# Altium schematic sheet control.SchDoc
size B
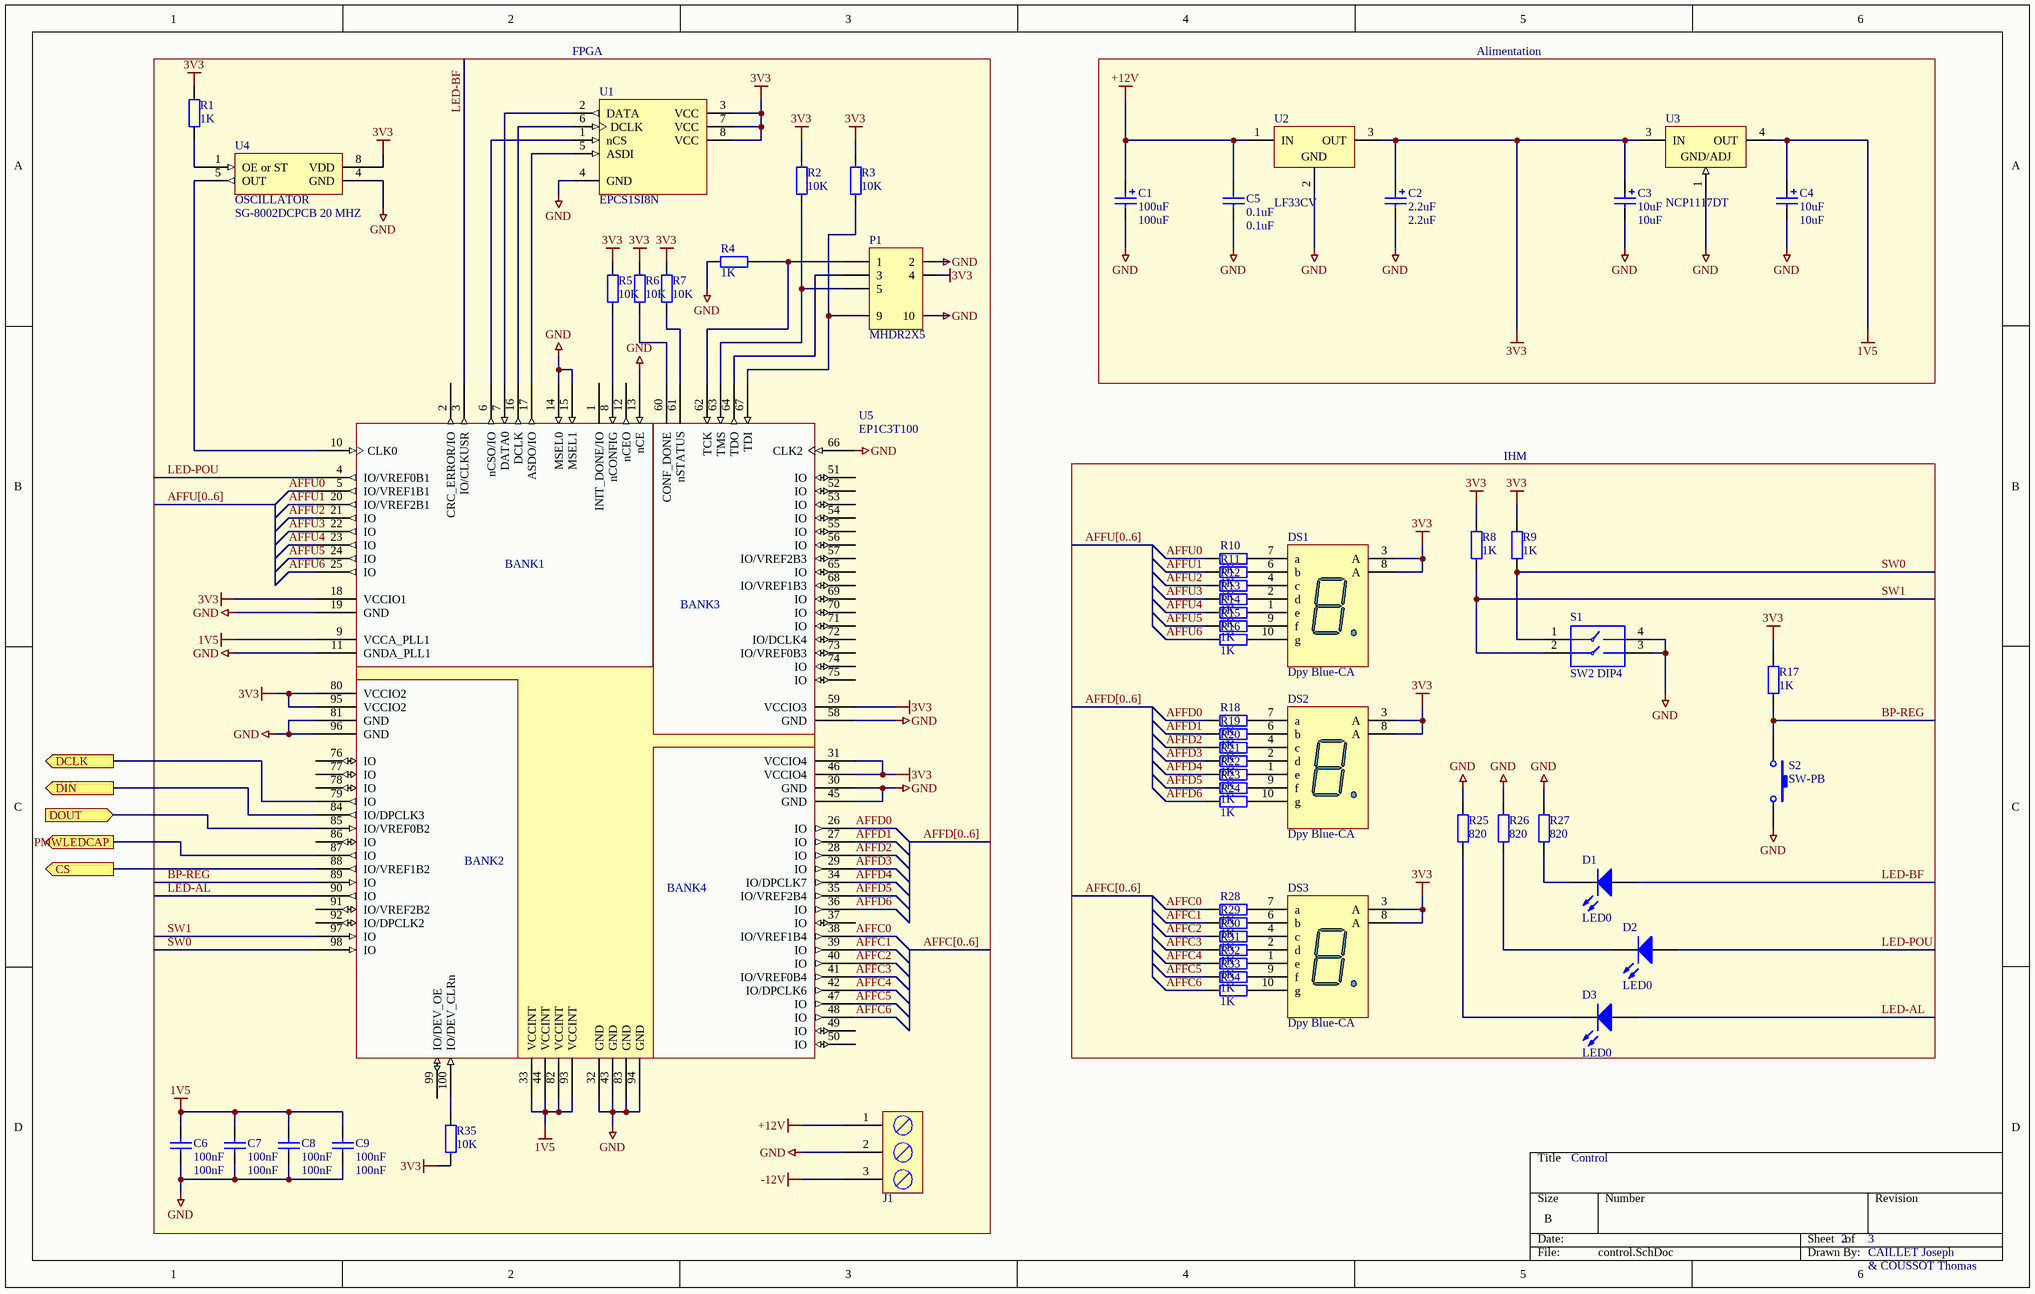
[diagram p0: control.SchDoc]

## Parts
C1  100uF  [RB0.14/0.35]
C2  2.2uF  [RB0.1/0.2]
C3  10uF  [RB0.1/0.2]
C4  10uF  [RB0.1/0.2]
C5  0.1uF  [RAD-0.2]
C6  100nF  [RAD-0.2]
C7  100nF  [RAD-0.2]
C8  100nF  [RAD-0.2]
C9  100nF  [RAD-0.2]
D1  LED0  [led-3mm]
D2  LED0  [led-3mm]
D3  LED0  [led-3mm]
DS1  Dpy Blue-CA  [AFF7SEG-14MM]
DS2  Dpy Blue-CA  [AFF7SEG-14MM]
DS3  Dpy Blue-CA  [AFF7SEG-14MM]
J1  BORNIER 3 VIS  [BORNIER-3]  (value not drawn)
P1  MHDR2X5  [HE10-2X5M]
R1  1K  [AXIAL-0.4]
R2  10K  [AXIAL-0.4]
R3  10K  [AXIAL-0.4]
R4  1K  [AXIAL-0.4]
R5  10K  [AXIAL-0.4]
R6  10K  [AXIAL-0.4]
R7  10K  [AXIAL-0.4]
R8  1K  [AXIAL-0.4]
R9  1K  [AXIAL-0.4]
R10  1K  [AXIAL-0.4]
R11  1K  [AXIAL-0.4]
R12  1K  [AXIAL-0.4]
R13  1K  [AXIAL-0.4]
R14  1K  [AXIAL-0.4]
R15  1K  [AXIAL-0.4]
R16  1K  [AXIAL-0.4]
R17  1K  [AXIAL-0.4]
R18  1K  [AXIAL-0.4]
R19  1K  [AXIAL-0.4]
R20  1K  [AXIAL-0.4]
R21  1K  [AXIAL-0.4]
R22  1K  [AXIAL-0.4]
R23  1K  [AXIAL-0.4]
R24  1K  [AXIAL-0.4]
R25  820  [AXIAL-0.4]
R26  820  [AXIAL-0.4]
R27  820  [AXIAL-0.4]
R28  1K  [AXIAL-0.4]
R29  1K  [AXIAL-0.4]
R30  1K  [AXIAL-0.4]
R31  1K  [AXIAL-0.4]
R32  1K  [AXIAL-0.4]
R33  1K  [AXIAL-0.4]
R34  1K  [AXIAL-0.4]
R35  10K  [AXIAL-0.4]
S1  SW2 DIP4  [DIP-4]
S2  SW-PB  [BP-MJTP12]
U1  EPCS1SI8N  [DIP-8]
U2  LF33CV  [REG-TO220]
U3  NCP1117DT  [REG-DPAK]
U4  SG-8002DCPCB 20 MHZ  [DIP-8]
U5  EP1C3T100  [SUPPORT-TQFP100]

## Blocks framed on the sheet
FPGA: C6-C9 J1 P1 R1-R7 R35 U1 U4 U5
Alimentation: C1-C5 U2 U3
IHM: D1-D3 DS1-DS3 R8-R34 S1 S2

## Ports
CS (out), DCLK (out), DIN (out), DOUT (in), PMWLEDCAP (out)

## Nets
1V5: C4.1 C6.2 C7.2 C8.2 C9.2 U3.4(OUT) U5.9(VCCA_PLL1) U5.33(VCCINT) U5.44(VCCINT) U5.82(VCCINT) U5.93(VCCINT)
3V3: C2.1 C3.1 DS1.3(A) DS1.8(A) DS2.3(A) DS2.8(A) DS3.3(A) DS3.8(A) P1.4 R1.1 R2.1 R3.1 R5.1 R6.1 R7.1 R8.2 R9.2 R17.2 R35.2 U1.3(VCC) U1.7(VCC) U1.8(VCC) U2.3(OUT) U3.3(IN) U4.8(VDD) U5.18(VCCIO1) U5.31(VCCIO4) U5.46(VCCIO4) U5.59(VCCIO3) U5.80(VCCIO2) U5.95(VCCIO2)
+12V: C1.1 C5.2 J1.1(X) U2.1(IN)
-12V: J1.3
GND: C1.2 C2.2 C3.2 C4.2 C5.1 C6.1 C7.1 C8.1 C9.1 J1.2 P1.2 P1.10 R4.2 R25.2 R26.2 R27.2 S1.3 S1.4 S2.2 U1.4(GND) U2.2(GND) U3.1(GND/ADJ) U4.4(GND) U5.11(GNDA_PLL1) U5.13(nCE) U5.14(MSEL0) U5.15(MSEL1) U5.19(GND) U5.30(GND) U5.32(GND) U5.43(GND) U5.45(GND) U5.58(GND) U5.66(CLK2) U5.81(GND) U5.83(GND) U5.94(GND) U5.96(GND)
AFFC0: R28.1 U5.38(IO/VREF1B4)
AFFC1: R29.1 U5.39(IO)
AFFC2: R30.1 U5.40(IO)
AFFC3: R31.1 U5.41(IO/VREF0B4)
AFFC4: R32.1 U5.42(IO/DPCLK6)
AFFC5: R33.1 U5.47(IO)
AFFC6: R34.1 U5.48(IO)
AFFD0: R18.1 U5.26(IO)
AFFD1: R19.1 U5.27(IO)
AFFD2: R20.1 U5.28(IO)
AFFD3: R21.1 U5.29(IO)
AFFD4: R22.1 U5.34(IO/DPCLK7)
AFFD5: R23.1 U5.35(IO/VREF2B4)
AFFD6: R24.1 U5.36(IO)
AFFU0: R10.1 U5.5(IO/VREF1B1)
AFFU1: R11.1 U5.20(IO/VREF2B1)
AFFU2: R12.1 U5.21(IO)
AFFU3: R13.1 U5.22(IO)
AFFU4: R14.1 U5.23(IO)
AFFU5: R15.1 U5.24(IO)
AFFU6: R16.1 U5.25(IO)
BP-REG: R17.1 S2.1 U5.89(IO)
CS: U5.88(IO/VREF1B2) ; port CS
DCLK: U5.79(IO) ; port DCLK
DIN: U5.84(IO/DPCLK3) ; port DIN
DOUT: U5.85(IO/VREF0B2) ; port DOUT
LED-AL: D3.1(A) U5.90(IO)
LED-BF: D1.1(A) U5.3(IO/CLKUSR)
LED-POU: D2.1(A) U5.4(IO/VREF0B1)
PMWLEDCAP: U5.87(IO) ; port PMWLEDCAP
SW0: R9.1 S1.1 U5.98(IO)
SW1: R8.1 S1.2 U5.97(IO)
NetD1_2: D1.2(K) R27.1
NetD2_2: D2.2(K) R26.1
NetD3_2: D3.2(K) R25.1
NetDS1_1: DS1.1(e) R14.2
NetDS1_2: DS1.2(d) R13.2
NetDS1_4: DS1.4(c) R12.2
NetDS1_6: DS1.6(b) R11.2
NetDS1_7: DS1.7(a) R10.2
NetDS1_9: DS1.9(f) R15.2
NetDS1_10: DS1.10(g) R16.2
NetDS2_1: DS2.1(e) R22.2
NetDS2_2: DS2.2(d) R21.2
NetDS2_4: DS2.4(c) R20.2
NetDS2_6: DS2.6(b) R19.2
NetDS2_7: DS2.7(a) R18.2
NetDS2_9: DS2.9(f) R23.2
NetDS2_10: DS2.10(g) R24.2
NetDS3_1: DS3.1(e) R32.2
NetDS3_2: DS3.2(d) R31.2
NetDS3_4: DS3.4(c) R30.2
NetDS3_6: DS3.6(b) R29.2
NetDS3_7: DS3.7(a) R28.2
NetDS3_9: DS3.9(f) R33.2
NetDS3_10: DS3.10(g) R34.2
NetP1_1: P1.1 R4.1 U5.62(TCK)
NetP1_3: P1.3 U5.64(TDO)
NetP1_5: P1.5 R2.2 U5.63(TMS)
NetP1_9: P1.9 R3.2 U5.67(TDI)
NetR1_2: R1.2 U4.1(OE_or_ST)
NetR5_2: R5.2 U5.8(nCONFIG)
NetR6_2: R6.2 U5.60(CONF_DONE)
NetR7_2: R7.2 U5.61(nSTATUS)
NetR35_1: R35.1 U5.100(IO/DEV_CLRn)
NetU1_1: U1.1(nCS) U5.6(nCSO/IO)
NetU1_2: U1.2(DATA) U5.7(DATA0)
NetU1_5: U1.5(ASDI) U5.17(ASDO/IO)
NetU1_6: U1.6(DCLK) U5.16(DCLK)
NetU4_5: U4.5(OUT) U5.10(CLK0)

Not connected (* = marked no-connect by the designer): DS1 5(DP); DS2 5(DP); DS3 5(DP); P1 6 7 8; U5 1(INIT_DONE/IO) 2(CRC_ERROR/IO) 12(nCEO) 37(IO) 49(IO) 50(IO) 51(IO) 52(IO) 53(IO) 54(IO) 55(IO) 56(IO) 57(IO/VREF2B3) 65(IO) 68(IO/VREF1B3) 69(IO) 70(IO) 71(IO) 72(IO/DCLK4) 73(IO/VREF0B3) 74(IO) 75(IO) 76(IO) 77(IO) 78(IO) 86(IO) 91(IO/VREF2B2) 92(IO/DPCLK2) 99(IO/DEV_OE)

## Buses and harness runs
bus AFFC[0..6]
bus AFFD[0..6]
bus AFFU[0..6]

## Notes on the sheet
- Control
- 2
- 3
- CAILLET Joseph
- & COUSSOT Thomas
- (in symbol EP1C3T100) BANK1; BANK3; BANK2; BANK4
- (in symbol SG-8002DCPCB 20 MHZ) OSCILLATOR

## Library data of the parts
C1-C4 = Cap Pol2: Electrolytic Polarized Capacitor (Axial); Published: 8-Jun-2000; LatestRevisionDate: 17-Jul-2002; LatestRevisionNote: Re-released for DXP Platform.; PackageReference: POLAR0.8; Publisher: Altium Limited; PackageDescription: Polarized Capacitor; 2 Leads
  C1: Value: 100uF
  C2: Value: 2.2uF
  C3 C4: Value: 10uF
C5-C9 = Cap: Ceramic Multilayer Capacitor; Published: 8-Jun-2000; LatestRevisionDate: 17-Jul-2002; LatestRevisionNote: Re-released for DXP Platform.; PackageReference: RAD-0.3; Publisher: Altium Limited; PackageDescription: Radial Cap, Thru-Hole; 2 Leads; 0.3 in Pin Spacing
  C5: Value: 0.1uF
  C6-C9: Value: 100nF
D1-D3 = LED0: Typical INFRARED GaAs LED; Published: 8-Jun-2000; LatestRevisionDate: 08-Jul-2005; LatestRevisionNote: Mech Layer 1 removed.; PackageReference: LED-0; Publisher: Altium Limited; PackageDescription: LED; 2 Leads
DS1-DS3 = Dpy Blue-CA: 14.2 mm General Purpose Blue 7-Segment Display: CA, RH DP, Gray Surface; MinimumIntensity: 2020 ucd; Note: IF = 10 mA; Published: 8-Jun-2000; LatestRevisionDate: 17-Dec-2003; LatestRevisionNote: Schematic revised, PCB Footprint replaced.; DatasheetVersion: 24-Sep-2002; PackageVersion: 24-Sep-2002; PackageReference: H; Publisher: Altium Limited; PackageDescription: LED, 7-Segment Display, 14.2 mm, RHD; 10 Leads; Row Space 15.24 mm; Pitch 2.54 mm; Colour: Blue; ComponentLink1Description: Manufacturer Link; ComponentLink1URL: http://www.agilent.com/
J1 = BORNIER-3: Bornier 3 cts
P1 = MHDR2X5: Header, 5-Pin, Dual row; LatestRevisionDate: 17-Jul-2002; LatestRevisionNote: Re-released for DXP Platform.; Publisher: Altium Limited
R1-R35 = Res2: Resistor; Published: 8-Jun-2000; LatestRevisionDate: 17-Jul-2002; LatestRevisionNote: Re-released for DXP Platform.; PackageReference: AXIAL-0.4; Publisher: Altium Limited; PackageDescription: Axial Device, Thru-Hole; 2 Leads; 0.4 in Pin Spacing
  R1 R4 R8-R24 R28-R34: Value: 1K
  R2 R3 R5-R7 R35: Value: 10K
  R25-R27: Value: 820
S1 = SW2-DIP4: Dual Switch in DIP 4 pin; Manufacturer: Generic Components; Published: 24-Mar-1999; Revision: July-2002: Re-released for DXP Platform.; Publisher: Altium Limited
S2 = SW-PB: Switch; Published: 24-Mar-1999; LatestRevisionDate: 17-Jul-2002; LatestRevisionNote: Re-released for DXP Platform.; PackageReference: SPST-2; Publisher: Altium Limited; PackageDescription: Switch; 2 Leads
U1 = EPCS1SI8N: EPCS1 Series, In-system programmable 3.3V serial configuration device, 8-Pin SOIC, 1-Megabit, Industrial Grade, Pb-Free; Configures: Cyclone II, Stratix II, & Cyclone Devices; Published: 4-Mar-2005; LatestRevisionDate: 13-Apr-2006; LatestRevisionNote: IPC-7351 Footprint Added.; DatasheetVersion: ver2.0, Oct-2003; PackageVersion: ver14.2, Oct-2005; PackageReference: SOIC8; Publisher: Altium Limited; PackageDescription: 8-Pin Small Outline Integrated Circuit Package (SOIC8); Supplier 1: Digi-Key; Supplier Part Number 1: 544-1242-5-ND; Supplier 2: Farnell; Supplier Part Number 2: 1453504; Code_JEDEC: MS-012-AA; Code_IPC: SOIC127P600-8; ComponentLink1Description: Manufacturer Link; ComponentLink1URL: http://www.altera.com/products/devices/config/cfg-index.html; ComponentLink2Description: Configuration Handbook; ComponentLink2URL: http://www.altera.com/literature/hb/cfg/config_handbook.pdf; ComponentLink3Description: Pinout Specification; ComponentLink3URL: http://www.altera.com/literature/hb/cfg/cyc_c51014.pdf; ComponentLink4Description: Packaging Specification; ComponentLink4URL: http://www.altera.com/literature/ds/dspkg.pdf
U2 = LF33CV: 500mA, Very Low Drop (0.45V) Voltage Regulator; Published: 24-Aug-2001; LatestRevisionDate: 06-Jun-2005; LatestRevisionNote: PCB Pin sequence re-ordered.; DatasheetVersion: Feb-2004; PackageVersion: Jul-2004; PackageReference: TO-220A; Publisher: Altium Limited; PackageDescription: TO, Thru-Hole, Vertical, Heatsink Mounted; 3 In-Line Leads; Pitch 2.54 mm; ComponentLink1Description: Manufacturer Link; ComponentLink1URL: http://www.st.com/; ComponentLink2Description: Datasheet; ComponentLink2URL: http://www.st.com/stonline/books/pdf/docs/2574.pdf
U3 = NCP1117DT: Low drop out Positive Fix. or Adj. Voltage Regulator; Manufacturer: ON Semiconductor; Package Information: Latest Revision: 1997; Class I: Power Management; Note: Pin 2 is electrically connected to Pin 4 (TAB); Pin 2 is trimmed and not drawn; Class II: Voltage Regulator
U4 = SG-8002DCPCB 20 MHZ: OSCILLATOR SG-8002DCPCB 20 MHZ 5V; Manufacturer: EPSON
U5 = EP1C3T100: FPGA CYCLONE 1 TQPF100; Manufacturer: ALTERA